# EAGLE design MultiWiiChassis_hex_power (EAGLE 6.4)
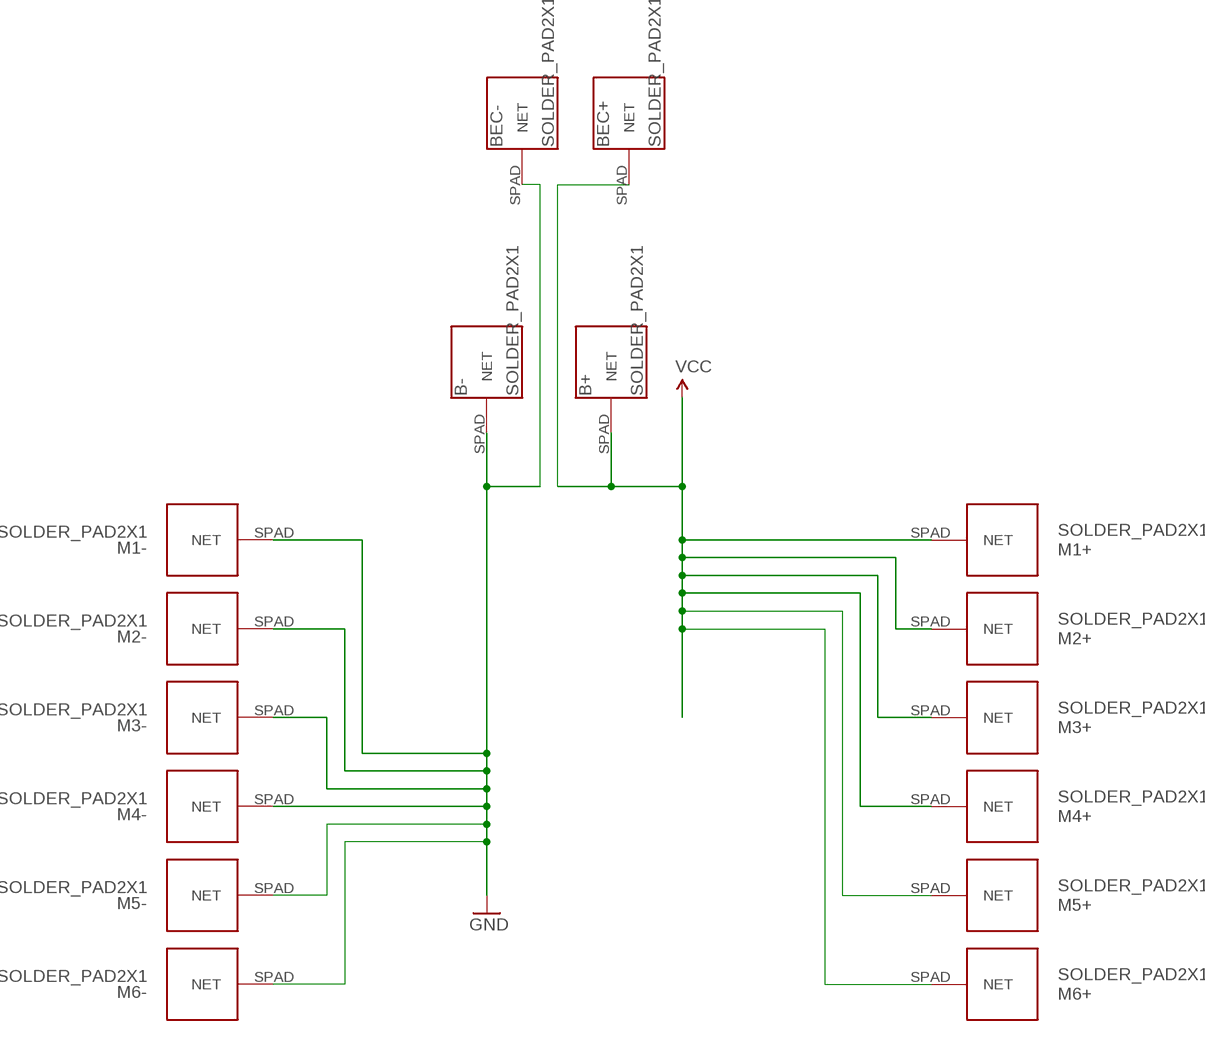
[diagram p0: schematic, sheet 1]

## Parts
B+  SOLDER_PAD2X1  [SOLDER_PAD_2X1]
B-  SOLDER_PAD2X1  [SOLDER_PAD_2X1]
BEC+  SOLDER_PAD2X1  [SOLDER_PAD_2X1]
BEC-  SOLDER_PAD2X1  [SOLDER_PAD_2X1]
M1+  SOLDER_PAD2X1  [SOLDER_PAD_2X1]
M1-  SOLDER_PAD2X1  [SOLDER_PAD_2X1]
M2+  SOLDER_PAD2X1  [SOLDER_PAD_2X1]
M2-  SOLDER_PAD2X1  [SOLDER_PAD_2X1]
M3+  SOLDER_PAD2X1  [SOLDER_PAD_2X1]
M3-  SOLDER_PAD2X1  [SOLDER_PAD_2X1]
M4+  SOLDER_PAD2X1  [SOLDER_PAD_2X1]
M4-  SOLDER_PAD2X1  [SOLDER_PAD_2X1]
M5+  SOLDER_PAD2X1  [SOLDER_PAD_2X1]
M5-  SOLDER_PAD2X1  [SOLDER_PAD_2X1]
M6+  SOLDER_PAD2X1  [SOLDER_PAD_2X1]
M6-  SOLDER_PAD2X1  [SOLDER_PAD_2X1]

## Nets
GND: B-.SPAD(NET) BEC-.SPAD(NET) M1-.SPAD(NET) M2-.SPAD(NET) M3-.SPAD(NET) M4-.SPAD(NET) M5-.SPAD(NET) M6-.SPAD(NET)
VCC: B+.SPAD(NET) BEC+.SPAD(NET) M1+.SPAD(NET) M2+.SPAD(NET) M3+.SPAD(NET) M4+.SPAD(NET) M5+.SPAD(NET) M6+.SPAD(NET)

## Library data of the parts
B+ B- BEC+ BEC- M1+ M1- M2+ M2- M3+ M3- M4+ M4- M5+ M5- M6+ M6- = JCM:SOLDER_PAD

## Board
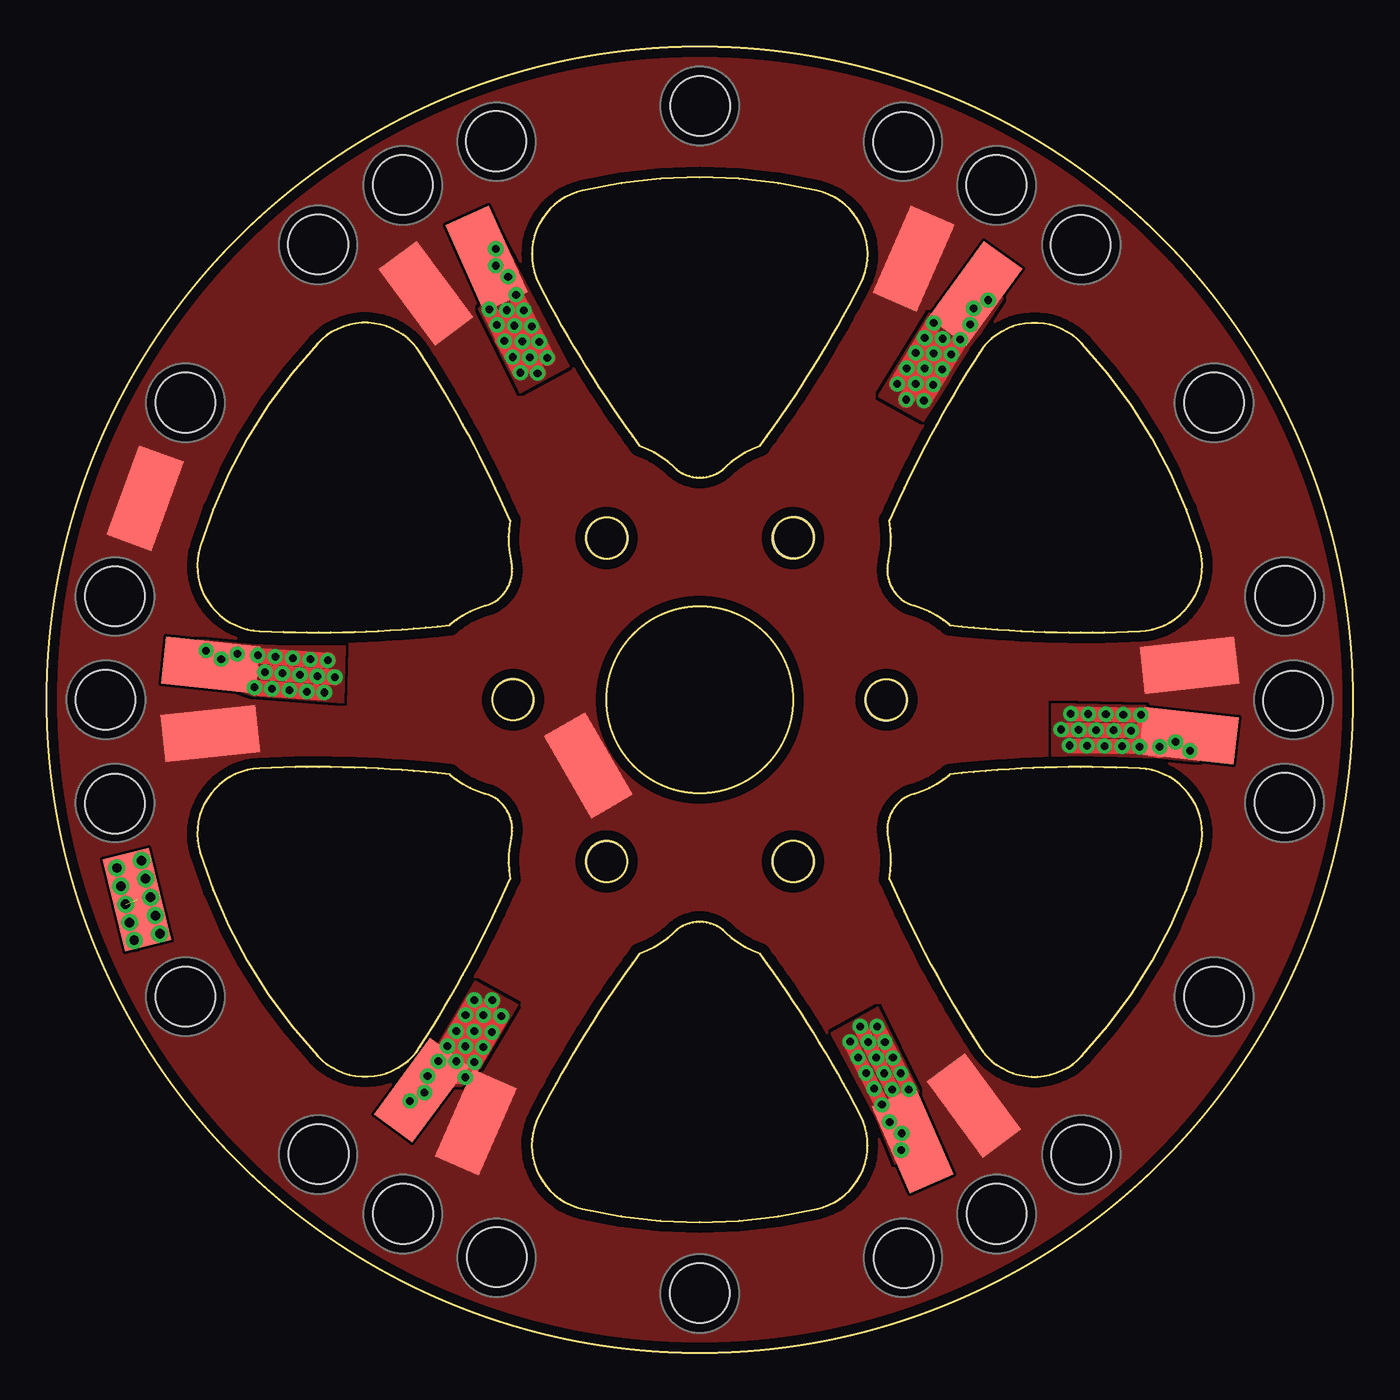
[diagram p1: board, top side]
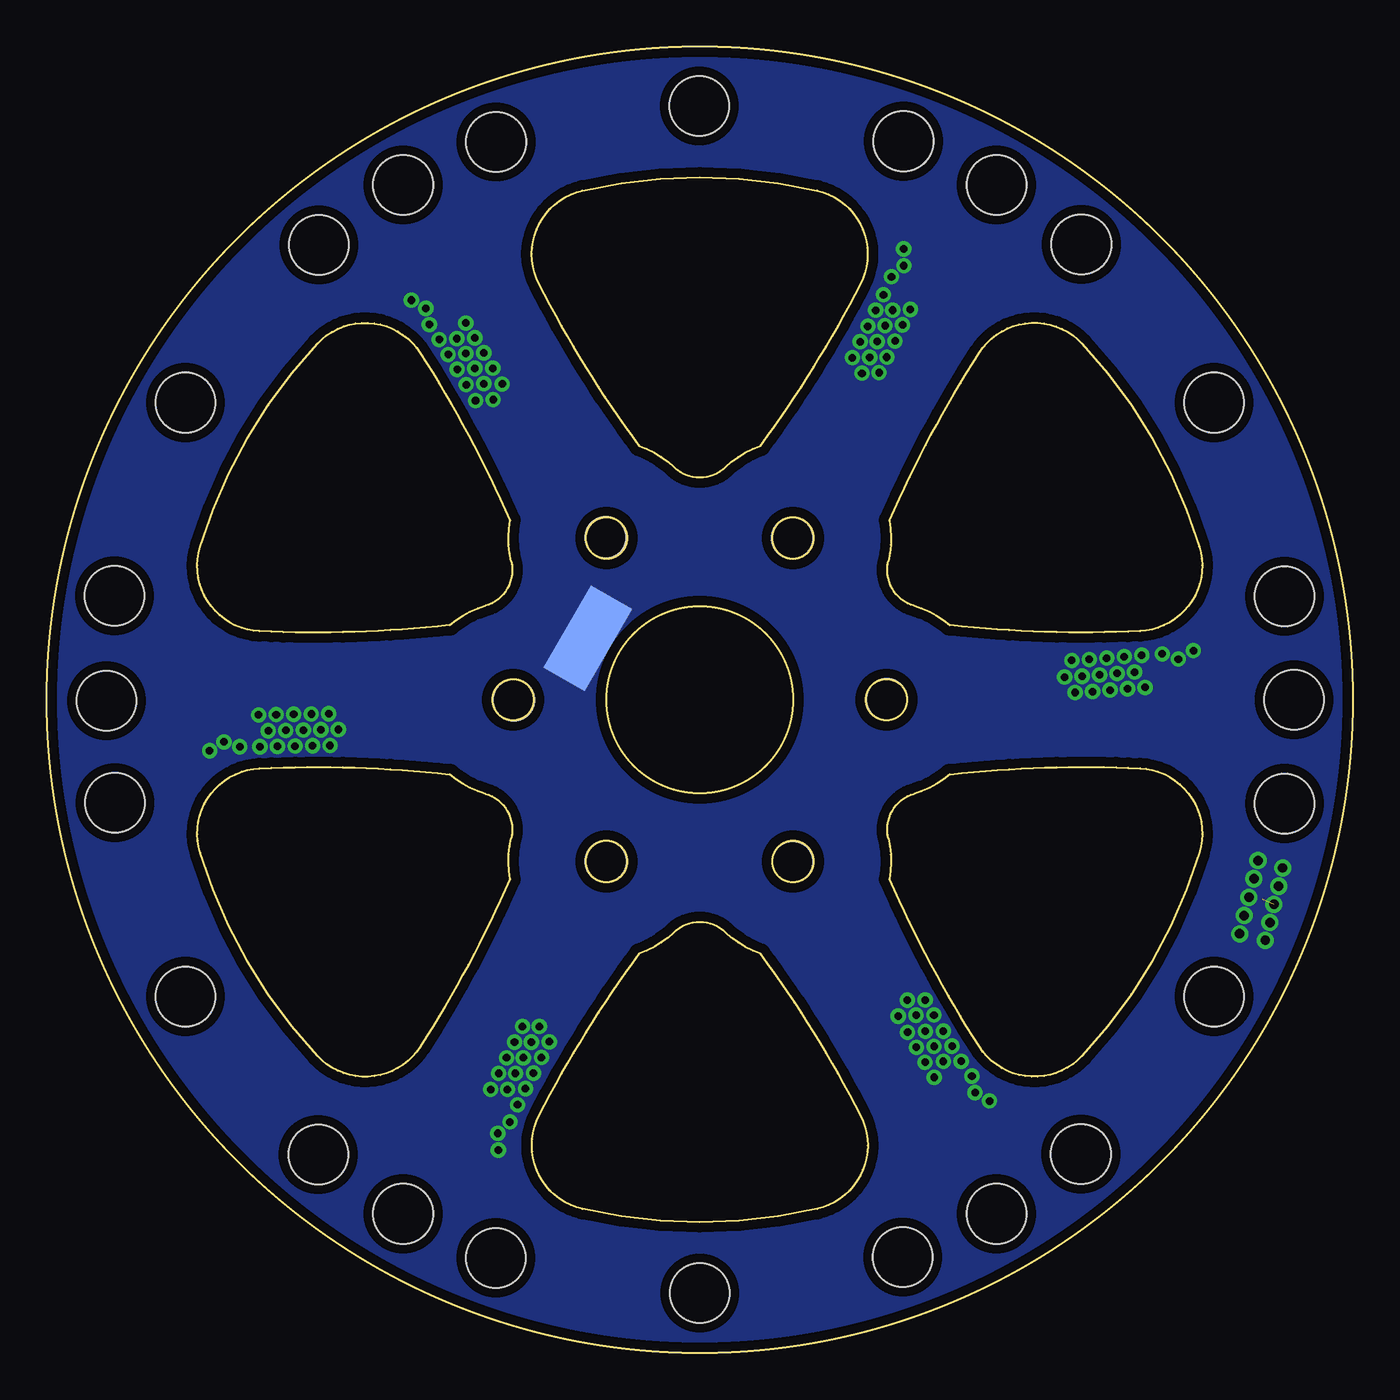
[diagram p2: board, bottom side, seen from below]

Size 70 x 70 mm. Coordinates in mm from the lower left corner, seen from the top.
Outline: 20.02,16.41 20.36,16.95 20.7,17.49 21.03,18.04 21.35,18.58 21.67,19.13 21.99,19.69 22.3,20.25 22.6,20.8 22.9,21.37 23.19,21.93 23.48,22.5 23.76,23.07 24.04,23.65 24.31,24.23 24.57,24.81 24.84,25.39 arc-24 24.9,27.57 arc87 23.52,29.96 arc-24 21.6,31 20.96,31.07 20.33,31.13 19.69,31.18 19.05,31.23 18.41,31.27 17.78,31.31 17.14,31.34 16.5,31.36 15.87,31.38 15.23,31.39 14.59,31.4 13.96,31.39 13.32,31.38 12.68,31.37 12.05,31.35 11.41,31.32 arc104 8.23,26.8 arc26 14.51,15.91 arc104 20.02,16.41
Outline: 43.61,12.73 43.31,13.3 43.01,13.86 42.7,14.42 42.39,14.97 42.08,15.52 41.75,16.07 41.43,16.62 41.09,17.16 40.76,17.7 40.41,18.24 40.06,18.77 39.71,19.3 39.35,19.83 38.98,20.36 38.61,20.88 38.24,21.39 arc-24 36.38,22.54 arc87 33.62,22.54 arc-24 31.76,21.39 31.39,20.88 31.02,20.36 30.65,19.83 30.29,19.3 29.94,18.77 29.59,18.24 29.24,17.7 28.9,17.16 28.57,16.62 28.24,16.07 27.92,15.52 27.6,14.97 27.29,14.42 26.98,13.86 26.68,13.3 26.39,12.73 arc104 28.71,7.71 arc26 41.28,7.71 arc104 43.61,12.73
Outline: 58.59,31.32 57.95,31.35 57.31,31.37 56.68,31.38 56.04,31.39 55.4,31.39 54.77,31.39 54.13,31.38 53.49,31.36 52.86,31.34 52.22,31.31 51.58,31.27 50.95,31.23 50.31,31.18 49.67,31.13 49.04,31.07 48.4,31 arc-24 46.48,29.96 arc87 45.1,27.57 arc-24 45.16,25.39 45.42,24.81 45.69,24.23 45.96,23.65 46.24,23.07 46.52,22.5 46.81,21.93 47.1,21.36 47.4,20.8 47.7,20.24 48.01,19.68 48.33,19.13 48.65,18.58 48.97,18.03 49.3,17.49 49.64,16.95 49.98,16.41 arc104 55.48,15.91 arc26 61.77,26.8 arc104 58.59,31.32
Outline: 49.98,53.59 49.64,53.05 49.3,52.51 48.97,51.96 48.65,51.42 48.33,50.87 48.01,50.31 47.7,49.76 47.4,49.2 47.1,48.63 46.81,48.07 46.52,47.5 46.24,46.92 45.96,46.35 45.69,45.77 45.42,45.19 45.16,44.6 arc-24 45.1,42.43 arc87 46.48,40.04 arc-24 48.4,39 49.04,38.93 49.67,38.87 50.31,38.82 50.95,38.77 51.59,38.73 52.22,38.69 52.86,38.66 53.49,38.64 54.13,38.62 54.77,38.61 55.41,38.6 56.04,38.61 56.68,38.62 57.32,38.63 57.95,38.65 58.59,38.68 arc104 61.77,43.2 arc26 55.49,54.09 arc104 49.98,53.59
Outline: 26.39,57.27 26.69,56.7 26.99,56.14 27.3,55.58 27.61,55.03 27.92,54.48 28.25,53.93 28.57,53.38 28.91,52.84 29.24,52.3 29.59,51.76 29.94,51.23 30.29,50.7 30.65,50.17 31.02,49.65 31.39,49.12 31.76,48.6 arc-24 33.62,47.46 arc87 36.38,47.46 arc-24 38.24,48.6 38.61,49.12 38.98,49.64 39.35,50.17 39.71,50.7 40.06,51.23 40.41,51.76 40.76,52.3 41.1,52.84 41.43,53.38 41.76,53.92 42.08,54.48 42.4,55.03 42.71,55.58 43.02,56.14 43.32,56.7 43.61,57.27 arc104 41.29,62.28 arc26 28.72,62.29 arc104 26.39,57.27
Outline: 11.41,38.68 12.05,38.65 12.69,38.63 13.32,38.62 13.96,38.61 14.6,38.61 15.23,38.61 15.87,38.62 16.51,38.64 17.14,38.66 17.78,38.69 18.42,38.73 19.05,38.77 19.69,38.82 20.33,38.87 20.96,38.93 21.6,39 arc-24 23.52,40.04 arc87 24.9,42.43 arc-24 24.84,44.6 24.57,45.19 24.31,45.77 24.04,46.35 23.76,46.93 23.48,47.5 23.19,48.07 22.9,48.63 22.6,49.2 22.3,49.76 21.99,50.32 21.68,50.87 21.36,51.42 21.03,51.97 20.7,52.51 20.36,53.05 20.02,53.59 arc104 14.52,54.09 arc26 8.23,43.2 arc104 11.41,38.68
Outline: circle at 30,26.34 radius 1.1
Outline: circle at 40,26.34 radius 1.1
Outline: circle at 45,35 radius 1.1
Outline: circle at 40,43.66 radius 1.1
Outline: circle at 30,43.66 radius 1.1
Outline: circle at 25,35 radius 1.1
Outline: circle at 35,35 radius 5
Outline: circle at 35,35 radius 35
Copper layers (1*16): Top 0.0178mm / dielectric 59mil / Bottom 0.0178mm
Design rules "SSC-EAGLE-2Lyr_v1.0.0.3-JCM": minimum track width 6mil, minimum drill 12mil, track to track 6mil, track to pad 6mil, pad to pad 6mil, via to via 6mil, smd to smd 6mil, copper to edge 20mil, drill to drill 16mil, minimum pad ring 8mil, minimum via ring 8mil, stop-mask expansion 3mil, vias tented up to drill 0mil, thermal gap 10mil
Holes 2.2 mm at 30.02,26.32 30.03,43.66 40.03,43.7 44.98,34.99 40.01,26.34 24.98,35.02
Holes 3.2 mm at 19.1,62.58 50.9,62.58 66.8,34.95 50.9,7.45 19.1,7.45 3.15,35 3.66,40.54 3.66,29.44 7.44,50.92 14.55,59.41 24.09,64.93 45.92,64.9 35.02,66.82 55.41,59.37 62.56,50.92 66.36,40.56 66.35,29.48 62.56,19.1 55.45,10.63 45.94,5.09 35,3.2 24.13,5.13 14.57,10.65 7.44,19.1
vRestrict: 3 lines

### Footprints (pad centres in the part's own frame; a part is rotated, then mirrored left to right if it is on the bottom)
SOLDER_PAD_2X1 = smd 5.08 x 2.54: SPAD 0,0

### Placement (x,y rotation side)
B+  29.03,31.49 120 top
B-  40.99,38.3 240 bottom
BEC+  5.28,45.8 250 top
BEC-  4.84,24.29 104 top
M1+  20.32,56.79 126.5 top
M1-  23.57,58.64 114 top
M2+  8.77,33.19 186 top
M2-  8.79,36.86 174 top
M3+  61.24,36.84 6.3 top
M3-  61.21,33.06 353.7 top
M4+  46.47,58.64 66.5 top
M4-  49.77,56.78 54 top
M5+  23,12.35 246.3 top
M5-  20.07,14.07 233.7 top
M6+  49.69,13.26 306.3 top
M6-  46.41,11.39 293.7 top

### Tracks (layer width: path | path; a pad name or v marks a point on that pad's centre or on a via)
GND  (via drill 0.41, 0.51)  (1 unrouted)
  Top 0.813: v54.88,34.25 v58.64,34.19 v59.65,32.48 | v44.5,17.49 v46.2,14.11 v45.17,12.37 | v22.43,14.76 v20.42,14.83 | v54.37,33.41 v58.12,33.34 59.27,33.16 | v54.81,32.55 v58.57,32.48 59.67,32.28 | v43.06,16.67 v44.77,13.3 45.23,12.37 | v43.6,17.49 v45.3,14.11 45.77,13.19 | v21.95,15.62 20.97,14.83 | v20.99,15.63 20.32,14.95
  Top 0.864: v26.82,53.33 v25.16,56.69 24.61,57.68 | v47.01,51.03 v48.97,54.3 v49.49,55.1 | v24.36,18.05 v22.43,14.76 | M2-.SPAD 11.28,37.38 v15.07,37.11 | 11.66,36.48 v15.45,36.21 | 11.1,35.66 v14.89,35.39 | 26.32,52.51 v24.66,55.87 | 25.38,52.55 v23.72,55.91 | v24.98,53.35 24.43,54.34 | v23.88,18.9 v21.95,15.62 | v22.92,18.91 v20.99,15.63 | v45.59,51.92 v47.54,55.19 | v46.07,51.08 v48.02,54.35
  other vias: 3.76,25.99 5.08,26.39 5.3,25.41 4.23,24.03 3.98,25.01 5.57,24.41 5.82,23.44 4.69,22.11 6.07,22.46 4.45,23.06 8.54,37.63 10.22,37.45 11.31,37.38 12.25,37.31 13.19,37.23 14.13,37.16 9.35,37.17 24.08,59.16 24.73,57.67 25.57,55.87 24.06,58.26 25.99,55.02 26.4,54.19 50.46,56.42 48.48,53.5 48,52.71 47.52,51.88 49.67,55.98 61.27,32.27 57.7,34.21 56.76,34.22 55.82,34.24 60.5,32.74 45.79,10.87 45.78,14.98 45.35,15.81 44.92,16.65 45.82,11.77 19.47,13.5 22.93,15.57 23.4,16.38 23.86,17.18 20.25,13.95 11.69,36.48 12.63,36.41 13.57,36.33 14.51,36.26 11.13,35.66 12.07,35.59 13.01,35.51 13.95,35.44 25.07,55.05 25.49,54.2 25.89,53.35 26.31,52.5 24.13,55.09 24.54,54.22 25.39,52.53 57.19,33.36 56.25,33.37 55.31,33.39 57.63,32.5 56.69,32.52 55.75,32.53 44.34,14.16 43.91,14.99 43.48,15.83 44.88,14.98 44.45,15.81 44.02,16.65 22.44,16.43 22.91,17.23 23.41,18.1 21.48,16.44 21.95,17.24 22.45,18.11 47.05,54.39 46.57,53.59 46.09,52.77 47.54,53.55 47.06,52.76 46.58,51.93
  pour Bottom (isolate 0.152, no thermals): -3.66,73.25 71.03,73.62 70.83,-2.62 -3.76,-3.05
  pour Top (no thermals): 8.16,38.16 7.98,36.26 11.04,35.24 15.92,34.86 16,37.86 13.76,37.84 12.92,37.84 10.94,37.92 8.18,38.2 8.16,38.22
  pour Top (no thermals): 18.74,13.46 19.9,12.54 21.18,14.28 22.66,14.32 25.24,18.64 22.96,19.9 20.42,15.6 18.7,13.48
  pour Top (no thermals): 45.46,10.14 46.8,10.74 46.02,12.68 46.74,14.02 44.56,18.52 42.04,17.12 44.48,12.56
  pour Top (no thermals): 61.8,33.08 59.74,33.36 58.88,34.66 53.86,34.76 53.86,31.96 59.54,31.9 61.74,31.68 61.86,33.06
  pour Top (no thermals): 50.02,57.36 48.54,55.32 47.32,55.72 44.58,51.28 46.98,49.94 51.24,56.5 50.1,57.34 48.58,55.32
  pour Top (no thermals): 24.32,59.84 23,59.28 24.04,56.96 23.16,55.96 25.38,51.46 28,52.88 24.36,59.82
VCC
  pour Top (isolate 0.152, rank 2, no thermals): 71.12,73.2 71.03,-3.1 -4.37,-3.2 -4.27,73.1

### Text on the board
tDocu: + | J Moreland | MultiWiiChassis | HEXPower v2 | Engineering / LLC | -